# Altium schematic sheet PDB_Custom_MCU.SchDoc
size A; SheetNumber: 1; SheetTotal: 8
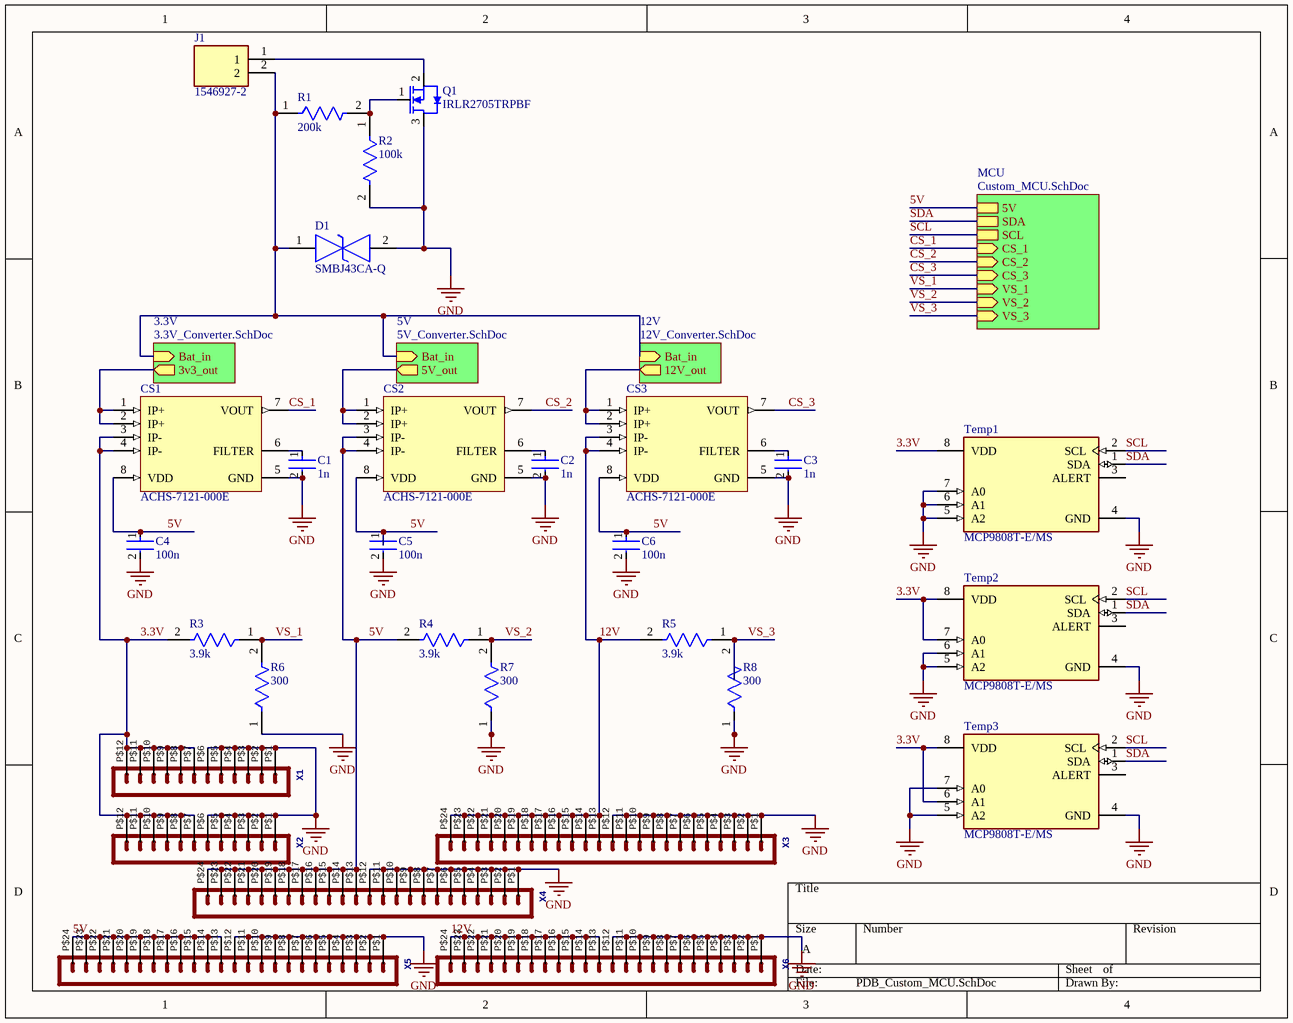
[diagram p0: PDB_Custom_MCU.SchDoc]

## Parts
C1  1n  [FP-0603-L_1_6_0_15-W_0_81-IPC_A]
C2  1n  [FP-0603-L_1_6_0_15-W_0_81-IPC_A]
C3  1n  [FP-0603-L_1_6_0_15-W_0_81-IPC_A]
C4  100n  [FP-CGA3E-0_3-0_1-IPC_A]
C5  100n  [FP-CGA3E-0_3-0_1-IPC_A]
C6  100n  [FP-CGA3E-0_3-0_1-IPC_A]
CS1  ACHS-7121-000E  [ACHS-7121-000E]
CS2  ACHS-7121-000E  [ACHS-7121-000E]
CS3  ACHS-7121-000E  [ACHS-7121-000E]
D1  SMBJ43CA-Q  [DIONM5436X244N]
J1  1546927-2  [SHDR2W119P0X826_1X2_1770X1549X1549P]
Q1  IRLR2705TRPBF  [IRLR2705TRPBF]
R1  200k  [FP-CRCW0603-e3-IPC_C]
R2  100k  [FP-RC0603-0_55-MFG]
R3  3.9k  [FP-CRCW0603-e3-IPC_A]
R4  3.9k  [FP-CRCW0603-e3-IPC_A]
R5  3.9k  [FP-CRCW0603-e3-IPC_A]
R6  300  [FP-CRCW0603-e3-IPC_A]
R7  300  [FP-CRCW0603-e3-IPC_A]
R8  300  [FP-CRCW0603-e3-IPC_A]
Temp1  MCP9808T-E/MS  [FP-C04-111-MFG]
Temp2  MCP9808T-E/MS  [FP-C04-111-MFG]
Temp3  MCP9808T-E/MS  [FP-C04-111-MFG]
X1  Molex - Micro-Fit 3.0 Series connector,  3.00mm (0.118") pitch header, 12 positions.  [44914-1201]  (value not drawn)
X2  Molex - Micro-Fit 3.0 Series connector,  3.00mm (0.118") pitch header, 12 positions.  [44914-1201]  (value not drawn)
X3  Molex - Micro-Fit 3.0 Series connector,  3.00mm (0.118") pitch header, 24 positions.  [44914-2401]  (value not drawn)
X4  Molex - Micro-Fit 3.0 Series connector,  3.00mm (0.118") pitch header, 24 positions.  [44914-2401]  (value not drawn)
X5  Molex - Micro-Fit 3.0 Series connector,  3.00mm (0.118") pitch header, 24 positions.  [44914-2401]  (value not drawn)
X6  Molex - Micro-Fit 3.0 Series connector,  3.00mm (0.118") pitch header, 24 positions.  [44914-2401]  (value not drawn)

## Sub-sheets
3.3V = 3.3V_Converter.SchDoc: 3v3_out (out), Bat_in (in)
5V = 5V_Converter.SchDoc: Bat_in (in), 5V_out (out)
12V = 12V_Converter.SchDoc: 12V_out (out), Bat_in (in)
MCU = Custom_MCU.SchDoc: CS_2 (in), CS_3 (in), CS_1 (in), 5V, VS_3 (in), VS_2 (in), VS_1 (in), SDA, SCL

## Nets
GND: C1.2 C2.2 C3.2 C4.2 C5.2 C6.2 CS1.5(GND) CS2.5(GND) CS3.5(GND) D1.2 Q1.3 R2.2 R6.1 R7.1 R8.1 Temp1.4(GND) Temp1.5(A2) Temp1.6(A1) Temp1.7(A0) Temp2.4(GND) Temp2.5(A2) Temp2.6(A1) Temp3.4(GND) Temp3.5(A2) Temp3.7(A0) X1.P$1 X1.P$2 X1.P$3 X1.P$4 X1.P$5 X1.P$6 X2.P$1 X2.P$2 X2.P$3 X2.P$4 X2.P$5 X2.P$6 X3.P$1 X3.P$2 X3.P$3 X3.P$4 X3.P$5 X3.P$6 X3.P$7 X3.P$8 X3.P$9 X3.P$10 X3.P$11 X3.P$12 X4.P$1 X4.P$2 X4.P$3 X4.P$4 X4.P$5 X4.P$6 X4.P$7 X4.P$8 X4.P$9 X4.P$10 X4.P$11 X4.P$12 X5.P$1 X5.P$2 X5.P$3 X5.P$4 X5.P$5 X5.P$6 X5.P$7 X5.P$8 X5.P$9 X5.P$10 X5.P$11 X5.P$12 X6.P$1 X6.P$2 X6.P$3 X6.P$4 X6.P$5 X6.P$6 X6.P$7 X6.P$8 X6.P$9 X6.P$10 X6.P$11 X6.P$12
3.3V: CS1.3(IP-) CS1.4(IP-) R3.2 Temp1.8(VDD) Temp2.7(A0) Temp2.8(VDD) Temp3.6(A1) Temp3.8(VDD) X1.P$7 X1.P$8 X1.P$9 X1.P$10 X1.P$11 X1.P$12 X2.P$7 X2.P$8 X2.P$9 X2.P$10 X2.P$11 X2.P$12
5V: C4.1 C5.1 C6.1 CS1.8(VDD) CS2.3(IP-) CS2.4(IP-) CS2.8(VDD) CS3.8(VDD) R4.2 X4.P$13 X4.P$14 X4.P$15 X4.P$16 X4.P$17 X4.P$18 X4.P$19 X4.P$20 X4.P$21 X4.P$22 X4.P$23 X4.P$24 X5.P$13 X5.P$14 X5.P$15 X5.P$16 X5.P$17 X5.P$18 X5.P$19 X5.P$20 X5.P$21 X5.P$22 X5.P$23 X5.P$24 ; sheet MCU/5V
12V: CS3.3(IP-) CS3.4(IP-) R5.2 X3.P$13 X3.P$14 X3.P$15 X3.P$16 X3.P$17 X3.P$18 X3.P$19 X3.P$20 X3.P$21 X3.P$22 X3.P$23 X3.P$24 X6.P$13 X6.P$14 X6.P$15 X6.P$16 X6.P$17 X6.P$18 X6.P$19 X6.P$20 X6.P$21 X6.P$22 X6.P$23 X6.P$24
CS_1: CS1.7(VOUT) ; sheet MCU/CS_1
CS_2: CS2.7(VOUT) ; sheet MCU/CS_2
CS_3: CS3.7(VOUT) ; sheet MCU/CS_3
SCL: Temp1.2(SCL) Temp2.2(SCL) Temp3.2(SCL) ; sheet MCU/SCL
SDA: Temp1.1(SDA) Temp2.1(SDA) Temp3.1(SDA) ; sheet MCU/SDA
VS_1: R3.1 R6.2 ; sheet MCU/VS_1
VS_2: R4.1 R7.2 ; sheet MCU/VS_2
VS_3: R5.1 R8.2 ; sheet MCU/VS_3
NetC1_1: C1.1 CS1.6(FILTER)
NetC2_1: C2.1 CS2.6(FILTER)
NetC3_1: C3.1 CS3.6(FILTER)
NetCS1_1: CS1.1(IP+) CS1.2(IP+) ; sheet 3.3V/3v3_out
NetCS2_1: CS2.1(IP+) CS2.2(IP+) ; sheet 5V/5V_out
NetCS3_1: CS3.1(IP+) CS3.2(IP+) ; sheet 12V/12V_out
NetD1_1: D1.1 J1.2 R1.1 ; sheet 3.3V/Bat_in, sheet 5V/Bat_in, sheet 12V/Bat_in
NetJ1_1: J1.1 Q1.2
NetQ1_1: Q1.1 R1.2 R2.1

Not connected (* = marked no-connect by the designer): Temp1 3(ALERT); Temp2 3(ALERT); Temp3 3(ALERT)

## Library data of the parts
C1-C3 = CMP-2006-04378-2: General Purpose Ceramic Capacitor, 0603, 1nF, 10%, X7R, 15%, 50V; Case Code (Metric): 1608; Min Operating Temperature: -55°C; Weight: 7.1E-05oz; Series: -; Capacitance: 1nF; RoHS Compliant: Yes; Radiation Hardening: No; Height: 0.9mm; Mount: Surface Mount; REACH SVHC: No SVHC; Lead Free: Lead Free; Depth: 0.81mm; Voltage: 50V; Number of Pins: 2; Voltage Rating: 50V; Max Operating Temperature: 125°C; Termination: SMD/SMT; Construction: Flat; Case Code (Imperial): 0603; Dielectric: X7R; Width: 0.032inch; Tolerance: 10%; Case/Package: 0603; Contact Plating: Tin; Packaging: Tape and Reel; Voltage Rating (DC): 50V; Dielectric Material: Ceramic; Package Quantity: 4000; Thickness: 0.035inch; Length: 1.6mm
C4-C6 = CMP-2000-07546-2: Cap Ceramic 100nF 50V X7R 10% Pad SMD 0603 +125°C Automotive T/R; Weight: 7.1E-05oz; Composition: Ceramic; Max Operating Temperature: 125°C; Termination: SMD/SMT; Dielectric: X7R; Length: 1.6mm; Package Quantity: 1; REACH SVHC: No SVHC; Lead Free: Lead Free; Case Code (Metric): 1608; Min Operating Temperature: -55°C; Packaging: Tape and Reel; Tolerance: 10%; Voltage Rating: 50V; Case Code (Imperial): 0603; Capacitance: 100nF; Case/Package: 0603; Voltage Rating (DC): 50V; Depth: 0.8mm; Radiation Hardening: No; Ratings: AEC-Q200; Mount: Surface Mount; Voltage: 50V; Thickness: 0.035inch; Width: 0.8mm; Height: 0.8mm
D1 = SMBJ43CA-Q: TVS Diode (Bi-directional); Manufacturer_Name: Bourns; Assembled: yes; Datasheet Link: https://www.bourns.com/docs/Product-Datasheets/SMBJ-Q.pdf; Height: 2.44mm; Manufacturer_Part_Number: SMBJ43CA-Q; Mouser Part Number: 652-SMBJ43CA-Q; Mouser Price/Stock: https://www.mouser.co.uk/ProductDetail/Bourns/SMBJ43CA-Q?qs=f9yNj16SXrKKVbIQ83PDKg%3D%3D; Arrow Part Number: SMBJ43CA-Q; Arrow Price/Stock: https://www.arrow.com/en/products/smbj43ca-q/bourns?region=nac; Distributor: JLCPCB; JLCPCB Part Number: C224021
J1 = 1546927-2: Connector; Manufacturer_Name: TE Connectivity; Datasheet Link: https://www.te.com/commerce/DocumentDelivery/DDEController?Action=showdoc&DocId=Customer+Drawing%7F1546927%7FA3%7Fpdf%7FEnglish%7FENG_CD_1546927_A3.pdf%7F1546927-2; Height: 15.494mm; Manufacturer_Part_Number: 1546927-2; Mouser Part Number: 571-1546927-2; Mouser Price/Stock: https://www.mouser.co.uk/ProductDetail/TE-Connectivity/1546927-2?qs=30v%252BXxGwGAoQPG4oeAAMCA%3D%3D; Arrow Part Number: 1546927-2; Arrow Price/Stock: https://www.arrow.com/en/products/1546927-2/te-connectivity
R1 = CMP-2000-03059-2: RES Thick Film, 200kΩ, 1%, 0.1W, 100ppm/°C, 0603; Resistance: 200kR; Voltage Rating (DC): 75V; Power Rating: 100mW; Termination: SMD/SMT; Depth: 0.85mm; Military Standard: Not; Case Code (Metric): 1608; Composition: Thick Film; Package Quantity: 10; Width: 0.033inch; Voltage Rating: 75V; Features: Automotive AEC-Q200; Max Power Dissipation: 100mW; Height: 0.45mm; Mount: Surface Mount; Max Operating Temperature: 155°C; Weight: 7.1E-05oz; Lead Free: Lead Free; Length: 1.55mm; Radiation Hardening: No; Case/Package: 0603; Packaging: Tape and Reel; Contact Plating: Tin; Min Operating Temperature: -55°C; Working Voltage: 75V; Temperature Coefficient: 100ppm/°C; Case Code (Imperial): 0603; Tolerance: 1%; Number of Terminations: 2
R2 = CMP-2100-03662-2: RES SMD 100K OHM 1% 1/10W 0603; Voltage Rating (DC): 50V; Resistance: 100kR; Max Power Dissipation: 100mW; Temperature Coefficient: 100ppm/°C; Working Voltage: 75V; Length: 1.6mm; Lead Free: Lead Free; Number of Terminations: 2; Packaging: Tape and Reel; Voltage Rating: 50V; Termination: SMD/SMT; Width: 0.8mm; Resistor Type: Thick Film; Resistance Tolerance: 1%; Features: Moisture Resistant; Height: 0.45mm; Construction: Rectangular; Case/Package: 0603; Military Standard: Not; Case Code (Imperial): 0603; Series: RC; Technology: THICK FILM; Depth: 0.8mm; RoHS Compliant: Yes; REACH SVHC: No SVHC; Min Operating Temperature: -55°C; Case Code (Metric): 1608; Max Operating Temperature: 155°C; Power Rating: 100mW; Number of Pins: 2; Tolerance: 1%
R3-R5 = CMP-02407-001779-1: RES Thick Film, 3.9kΩ, 1%, 0.1W, 100ppm/°C, 0603; Voltage Rating: 75V; Power Rating: 100mW; Resistance: 3.9kR; Case Code (Imperial): 0603; Military Standard: Not; Length: 1.55mm; Lead Free: Lead Free; Max Operating Temperature: 155°C; Working Voltage: 75V; Termination: SMD/SMT; Min Operating Temperature: -55°C; Contact Plating: Tin; Depth: 0.85mm; Packaging: Tape and Reel; Voltage Rating (DC): 75V; Tolerance: 1%; Features: Automotive AEC-Q200; Package Quantity: 10; Composition: Thick Film; Mount: Surface Mount; Width: 0.033inch; Radiation Hardening: No; Max Power Dissipation: 100mW; Height: 0.45mm; Temperature Coefficient: 100ppm/°C; Weight: 7.1E-05oz; Case Code (Metric): 1608; Case/Package: 0603; Number of Terminations: 2
R6-R8 = CMP-2000-03216-2: RES Thick Film, 300Ω, 1%, 0.1W, 100ppm/°C, 0603; Voltage Rating (DC): 75V; Power Rating: 100mW; Resistance: 300R; Length: 1.55mm; Height: 0.45mm; Case/Package: 0603; Temperature Coefficient: 100ppm/°C; Packaging: Tape and Reel; Termination: SMD/SMT; Depth: 0.85mm; Max Operating Temperature: 155°C; Radiation Hardening: No; Tolerance: 1%; Lead Free: Lead Free; Case Code (Metric): 1608; Voltage Rating: 75V; Weight: 7.1E-05oz; Package Quantity: 10; Military Standard: Not; Case Code (Imperial): 0603; Composition: Thick Film; Min Operating Temperature: -55°C; Width: 0.033inch; Number of Terminations: 2; Mount: Surface Mount; Features: Automotive AEC-Q200; Contact Plating: Tin; Max Power Dissipation: 100mW
Temp1-Temp3 = CMP-0192-00343-2: SENSOR DIGITAL -40C-125C 8MSOP; Interface: I2C; Operating Supply Current: 200uA; Resolution: 10b; Min Supply Voltage: 2.7V; Max Supply Voltage (DC): 5.5V; Width: 3mm; Height: 0.95mm; Package Quantity: 2500; Length: 3mm; Lead Free: Lead Free; Radiation Hardening: No; Number of Pins: 8; Min Supply Voltage (DC): 2.7V; Output Type: Digital; Packaging: Tape and Reel; Max Supply Voltage: 5.5V; Max Operating Temperature: 125°C; Case/Package: MSOP; Min Operating Temperature: -40°C
X1 X2 = HEADER_POS12_?44914-1201: GateName_1: G$1; SymbolName_1: HEADER_POS12; DeviceName: 44914-1201; LibraryName: con-molex-micro-fit-3_0_2; DeviceSetName: HEADER_POS12_?; Package: 44914-1201
X3-X6 = HEADER_POS24_?44914-2401: GateName_1: G$1; SymbolName_1: HEADER_POS24; DeviceName: 44914-2401; LibraryName: con-molex-micro-fit-3_0_2; DeviceSetName: HEADER_POS24_?; Package: 44914-2401